# EAGLE design pendrive (EAGLE 6.4)
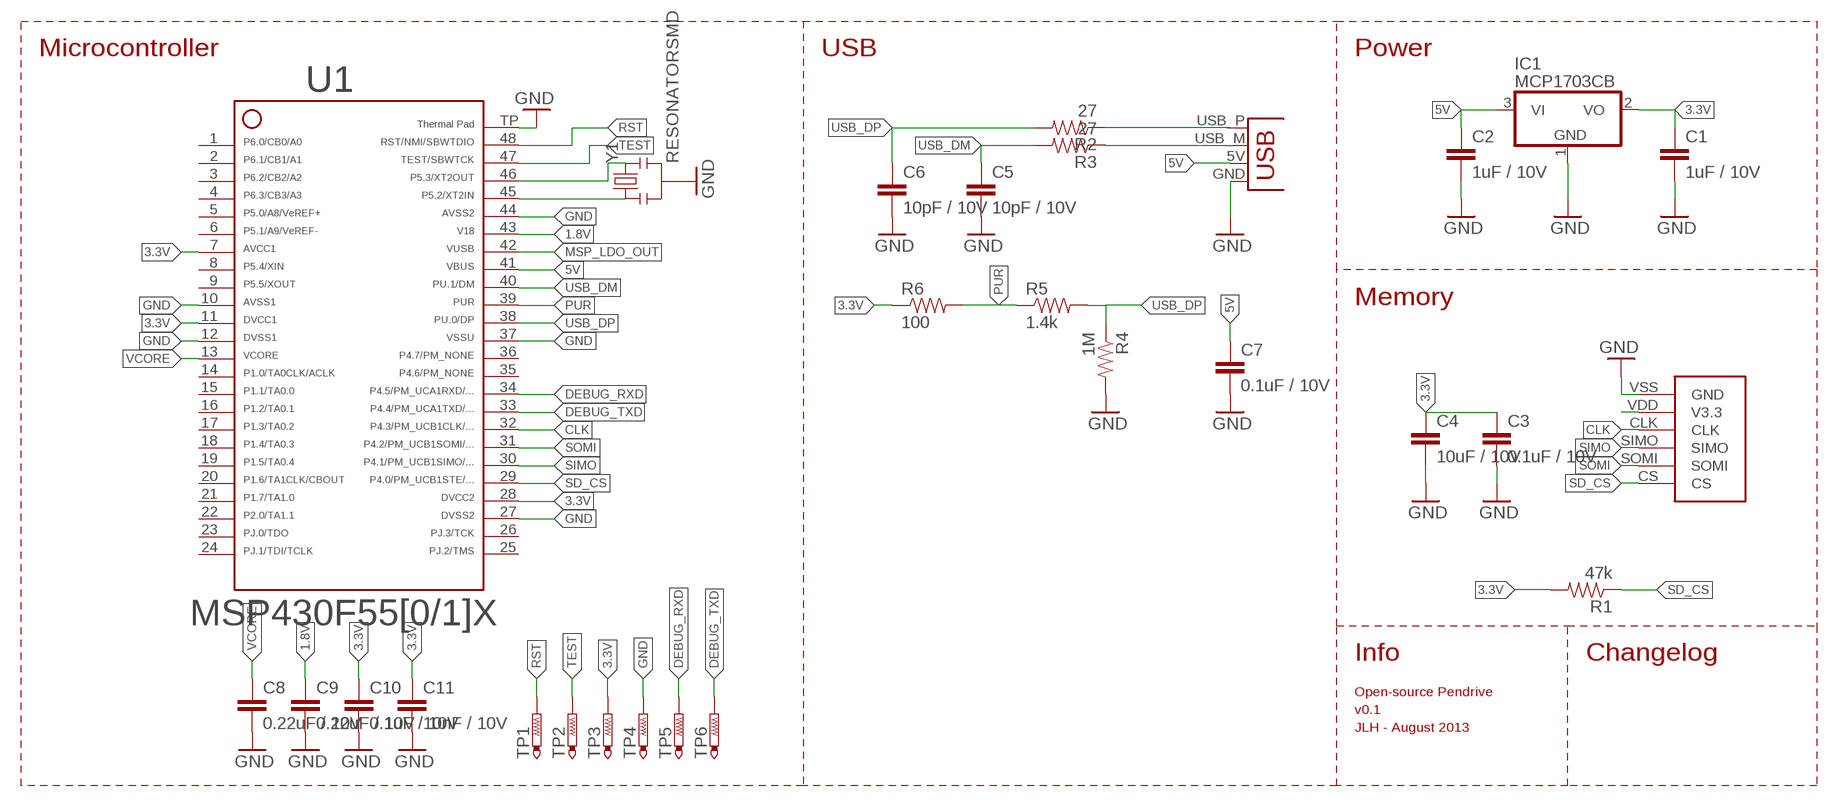
[diagram p0: schematic, sheet 1]

## Parts
C1  1uF / 10V  CAP0402-CAP  [0402-CAP]
C2  1uF / 10V  CAP0402-CAP  [0402-CAP]
C3  0.1uF / 10V  CAP0402-CAP  [0402-CAP]
C4  10uF / 10V  CAP1206  [1206]
C5  10pF / 10V  CAP0402-CAP  [0402-CAP]
C6  10pF / 10V  CAP0402-CAP  [0402-CAP]
C7  0.1uF / 10V  CAP0402-CAP  [0402-CAP]
C8  0.22uF / 10V  CAP0402-CAP  [0402-CAP]
C9  0.22uF / 10V  CAP0402-CAP  [0402-CAP]
C10  0.1uF / 10V  CAP0402-CAP  [0402-CAP]
C11  10nF / 10V  CAP0402-CAP  [0402-CAP]
IC1  MCP1703CB  [SOT23]
R1  47k  RESISTOR0402-RES  [0402-RES]
R2  27  RESISTOR0402-RES  [0402-RES]
R3  27  RESISTOR0402-RES  [0402-RES]
R4  1M  RESISTOR0402-RES  [0402-RES]
R5  1.4k  RESISTOR0402-RES  [0402-RES]
R6  100  RESISTOR0402-RES  [0402-RES]
TP1  PTR1TP10SQ  [TP10SQ]
TP2  PTR1TP10SQ  [TP10SQ]
TP3  PTR1TP10SQ  [TP10SQ]
TP4  PTR1TP10SQ  [TP10SQ]
TP5  PTR1TP10SQ  [TP10SQ]
TP6  PTR1TP10SQ  [TP10SQ]
U1  F55[0/1]X---RGZ48  [RGZ48]
U2  MICROSD-MOLEX  [MICROSD-MOLEX]
X1  USBPCB  [USB-A-PCB]
Y1  RESONATORSMD  [RESONATOR-SMD]

## Nets
1.8V: C9.1 U1.43
3.3V: C1.1 C3.1 C4.1 C10.1 C11.1 IC1.2(VO) R1.2 R6.1 TP3.TP U1.7 U1.11 U1.28 U2.VDD(V3.3)
5V: C2.1 C7.1 IC1.3(VI) U1.41 X1.5V(VBUS)
CLK: U1.32 U2.CLK
DEBUG_RXD: TP5.TP U1.34
DEBUG_TXD: TP6.TP U1.33
GND: C1.2 C2.2 C3.2 C4.2 C5.2 C6.2 C7.2 C8.2 C9.2 C10.2 C11.2 IC1.1(GND) R4.2 TP4.TP U1.10 U1.12 U1.27 U1.37 U1.44 U1.TP U2.VSS(GND) X1.GND Y1.2
MSP_LDO_OUT: U1.42
N$1: R2.1 X1.USB_P(D+)
N$2: R3.1 X1.USB_M(D-)
N$4: U1.45 Y1.1
N$5: U1.46 Y1.3
PUR: R5.1 R6.2 U1.39
RST: TP1.TP U1.48
SD_CS: R1.1 U1.29 U2.CS
SIMO: U1.30 U2.SIMO
SOMI: U1.31 U2.SOMI
TEST: TP2.TP U1.47
USB_DM: C5.1 R3.2 U1.40
USB_DP: C6.1 R2.2 R4.1 R5.2 U1.38
VCORE: C8.1 U1.13
Unconnected: U1.1 U1.2 U1.3 U1.4 U1.5 U1.6 U1.8 U1.9 U1.14 U1.15 U1.16 U1.17 U1.18 U1.19 U1.20 U1.21 U1.22 U1.23 U1.24 U1.25 U1.26 U1.35 U1.36

## Notes on the sheet
- Microcontroller | USB | Power
- Memory
- Info | Changelog
- Open-source Pendrive
- v0.1
- JLH - August 2013

## Library data of the parts
C1-C11 = SparkFun:CAP: Capacitor Standard 0603 ceramic capacitor, and 0.1" leaded capacitor.
IC1 = linear:MCP1703: 250 mA, 16V, Low Quiescent Current LDO Regulator Source: http://ww1.microchip.com/downloads/en/DeviceDoc/22049b.pdf
R1-R6 = SparkFun:RESISTOR: Resistor Basic schematic elements and footprints for 0603, 1206, and PTH resistors.
TP1-TP6 = testpad:PTR1: TEST PIN
U1 = TI_MSP430_v16:F55[0/1]X---RGZ48: ***F55[0/1/2]X*** RGZ48 Rev. 1.0 06/2010 "http://www.ti.com/lit/gpn/msp430f5509"
U2 = Satelinx:MICROSD-MOLEX
X1 = SparkFun:USB: USB Connectors USB-B-PTH is fully proven SKU : PRT-00139 USB-miniB is fully proven SKU : PRT-00587 USB-A-PCB is untested. USB-A-H is throughly reviewed, but untested. Spark Fun Electronics SKU : PRT-00437 USB-B-SMT is throughly reviewed, but untested. Needs silkscreen touching up. USB-A-S has not been used/tested USB-MB-H has not been used/tested
Y1 = SparkFun:RESONATOR: Resonator Small SMD resonator. This is the itty bitty 10/20MHz resonators with built in caps. CSTCE10M0G55 and CSTCE20M0V53. Footprint has been reviewed closely but hasn't been tested yet.

## Board
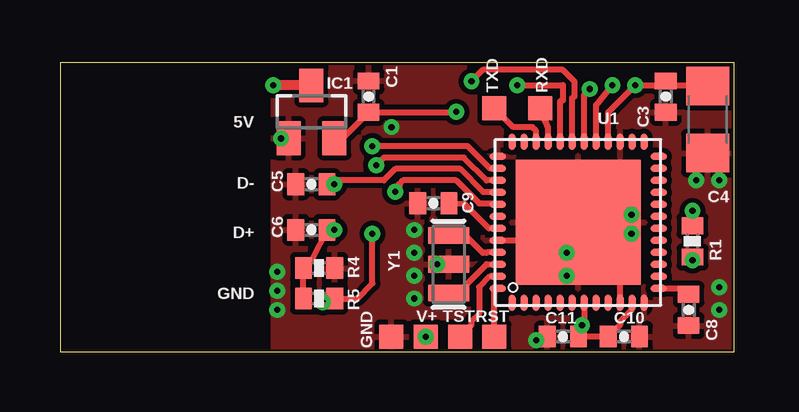
[diagram p1: board, top side]
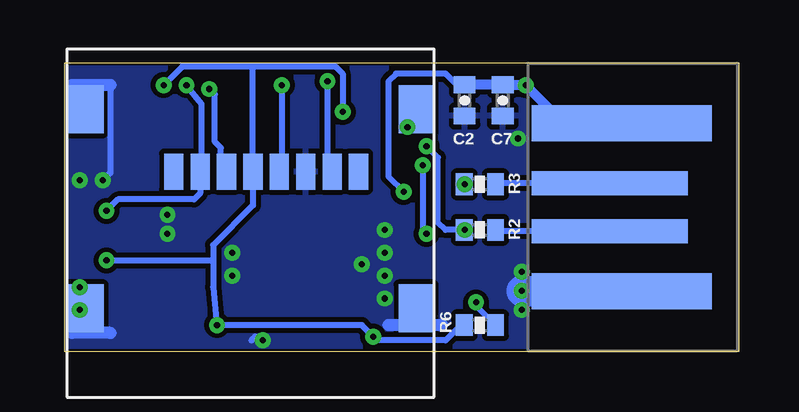
[diagram p2: board, bottom side, seen from below]

Size 28.09 x 12.05 mm. Coordinates in mm from the lower left corner, seen from the top.
Outline: 0,0 28.09,0 28.09,12.05 0,12.05 0,0
Copper layers (1*16): Top 0.035mm / dielectric 1.5mm / Bottom 0.035mm
Design rules "default *": minimum track width 8mil, minimum drill 10mil, track to track 8mil, track to pad 8mil, pad to pad 8mil, via to via 8mil, smd to smd 8mil, copper to edge 4mil, drill to drill 8mil, minimum pad ring 10mil, minimum via ring 8mil, stop-mask expansion 4mil, vias tented up to drill 0mil, thermal gap 8mil

### Footprints (pad centres in the part's own frame; a part is rotated, then mirrored left to right if it is on the bottom)
0402-CAP = smd 0.7 x 0.9: 1 -0.65,0; 2 0.65,0
1206 = smd 1.6 x 1.8: 1 -1.4,0; 2 1.4,0
SOT23 = smd 1 x 1.4: 1 -0.95,-1.1; 2 0.95,-1.1; 3 0,1.1
0402-RES = smd 0.7 x 0.9: 1 -0.65,0; 2 0.65,0
TP10SQ = smd 1 x 1: TP 0,0
RGZ48 = smd 0.7 x 0.3: 1 -3.35,2.75; 2 -3.35,2.25; 3 -3.35,1.75; 4 -3.35,1.25; 5 -3.35,0.75; 6 -3.35,0.25; 7 -3.35,-0.25; 8 -3.35,-0.75; 9 -3.35,-1.25; 10 -3.35,-1.75; 11 -3.35,-2.25; 12 -3.35,-2.75; 25 3.35,-2.75; 26 3.35,-2.25; 27 3.35,-1.75; 28 3.35,-1.25; 29 3.35,-0.75; 30 3.35,-0.25; 31 3.35,0.25; 32 3.35,0.75; 33 3.35,1.25; 34 3.35,1.75; 35 3.35,2.25; 36 3.35,2.75 | smd 0.3 x 0.7: 13 -2.75,-3.35; 14 -2.25,-3.35; 15 -1.75,-3.35; 16 -1.25,-3.35; 17 -0.75,-3.35; 18 -0.25,-3.35; 19 0.25,-3.35; 20 0.75,-3.35; 21 1.25,-3.35; 22 1.75,-3.35; 23 2.25,-3.35; 24 2.75,-3.35; 37 2.75,3.35; 38 2.25,3.35; 39 1.75,3.35; 40 1.25,3.35; 41 0.75,3.35; 42 0.25,3.35; 43 -0.25,3.35; 44 -0.75,3.35; 45 -1.25,3.35; 46 -1.75,3.35; 47 -2.25,3.35; 48 -2.75,3.35 | smd 5.2 x 5.2: TP 0,0
MICROSD-MOLEX = smd 0.8 x 1.5: CLK 6.45,3.6; CS 9.75,3.6; DAT1 3.15,3.6; DAT2 10.85,3.6; SIMO 8.65,3.6; SOMI 4.25,3.6; VDD 7.55,3.6; VSS 5.35,3.6 | smd 1.45 x 2: SHIELD1 0.75,9.3; SHIELD2 0.75,1; SHIELD3 14.5,1; SHIELD4 14.5,9.3
USB-A-PCB = smd 7.5 x 1.5: 5V -0.2,-3.5; GND -0.2,3.5 | smd 6.5 x 1: USB_M 0.3,-1; USB_P 0.3,1
RESONATOR-SMD = smd 0.7 x 1.7: 1 -1.2,0; 2 0,0; 3 1.2,0

### Placement (x,y rotation side)
C1  12.86,10.64 90 top
C2  11.43,10.48 270 bottom
C3  25.24,10.64 270 top
C4  26.99,9.68 270 top
C5  10.48,6.99 180 top
C6  10.48,5.08 180 top
C7  9.84,10.48 270 bottom
C8  26.19,1.75 270 top
C9  15.56,6.19 180 top
C10  23.5,0.64 0 top
C11  20.95,0.64 180 top
IC1  10.48,10 0 top
R1  26.35,4.6 270 top
R2  10.79,5.08 180 bottom
R3  10.79,6.99 180 bottom
R4  10.79,3.49 0 top
R5  10.79,2.22 180 top
R6  10.79,1.11 0 bottom
TP1  18.1,0.64 0 top
TP2  16.67,0.64 0 top
TP3  15.24,0.64 0 top
TP4  13.81,0.64 0 top
TP5  18.1,10.16 0 top
TP6  20,10.16 0 top
U1  21.59,5.4 90 top
U2  12.7,11.11 180 bottom
X1  5.08,6.03 180 bottom
Y1  16.19,3.65 270 top

### Tracks (layer width: path | path; a pad name or v marks a point on that pad's centre or on a via)
1.8V
  Top 0.254: C9.1 16.84,6.18 17.87,5.15 U1.43
3.3V  (via drill 0.25)
  Top 0.254: U1.7 21.84,1.2 v21.75,1.11 21.61,0.97 C11.1 C10.1 23.34,1.13 23.34,1.27 23.84,1.77 U1.11 | IC1.2 11.77,8.9 C1.1 16.5,9.99 v16.51,10 | U1.28 22.84,9.98 v23.97,11.11 25.39,11.11 | 25.39,11.11 C3.1 | 25.39,11.11 26.96,11.11 C4.1 | R1.2 v26.35,3.81
  Bottom 0.254: 20.16,11.91 23.18,11.91 v23.97,11.11 | 20.16,11.91 16.83,11.91 16.51,11.59 v16.51,10 | 20.16,11.91 20.25,11.82 U2.VDD 20.25,6.1 21.91,4.45 21.91,3.81 | 21.91,3.81 21.91,2.7 v21.75,1.11 21.61,1.13 21.61,1.11 15.72,1.11 TP3.TP 15.08,0.48 12.22,0.48 11.59,1.11 R6.1 | v26.35,3.81 21.91,3.81
  other vias: 15.24,0.64
5V  (via drill 0.25)
  Top 0.254: U1.41 18.2,6.19 17.46,6.19 16.51,7.14 14.29,7.14 14.13,6.99 14.13,6.83 v13.97,6.67
  Top 0.406: IC1.3 v8.9,11.1 v8.89,11.11
  Bottom 0.254: C2.1 11.76,11.13 12.22,11.59 14.29,11.59 14.61,11.27 14.61,7.3 v13.97,6.67
  Bottom 0.406: X1.5V 7.31,9.53 v8.89,11.11 8.9,11.13 C7.1 | 9.83,11.11 C7.1 | C7.1 C2.1
CLK  (via drill 0.25)
  Top 0.254: U1.32 20.84,10.43 20.95,10.48 20.95,11.11 v19.05,11.11
  Bottom 0.254: v19.05,11.11 19.05,7.89 U2.CLK
DEBUG_RXD
  Top 0.254: U1.34 19.84,9.21 19.68,9.37 18.89,9.37 TP5.TP
DEBUG_TXD
  Top 0.254: U1.33 20.34,9.35 TP6.TP
GND  (via drill 0.25)
  Top 0.254: U1.44 20.59,4.65 v21.11,4.13 | U1.10 23.34,4.45 v23.81,4.92 | C11.2 v19.84,0.48
  Top 0.508: v21.11,4.13 23.02,4.13 v23.81,4.92
  Bottom 0.254: v19.84,0.48 20.16,0.64 20.32,0.48 | 26.19,11.11 26.19,7.46 v26.51,7.14 | 26.19,0.79 26.51,0.79 v27.46,1.75
  Bottom 0.508: 12.38,1.11 14.61,1.11 | 26.19,11.11 27.78,11.11 | 26.19,0.79 27.78,0.79
  Bottom 1.27: X1.GND v9.04,2.53 v9.05,2.54
  other vias: 9.05,3.33 9.05,1.75 14.76,2.22 14.76,3.17 14.76,4.13 14.76,5.08 15.72,3.65 23.81,5.71 13.81,9.37 27.46,2.7 21.11,3.17 27.46,7.14 9.21,8.89
  pour Bottom: 8.89,12.06 8.89,0 28.26,0 28.26,12.06
  pour Top: 8.89,12.06 8.89,0 28.26,0 28.26,12.06
N$1
  Bottom 0.254: X1.USB_P 10.1,5.03 R2.1
N$2
  Bottom 0.254: X1.USB_M 10.1,7.03 R3.1
N$4
  Top 0.254: U1.45 17.8,4.15 17.78,4.13 17.62,4.13 16.83,4.92 16.26,4.92 Y1.1
N$5
  Top 0.254: Y1.3 16.58,2.45 17.78,3.65 U1.46
PUR  (via drill 0.25)
  Top 0.254: v13.02,4.92 13.02,2.86 12.38,2.22 R5.1 11.41,2.19 11.08,2.19 v10.95,2.06 | U1.39 17.78,7.15 16.83,8.1 13.49,8.1 v13.18,7.78
  Bottom 0.254: v13.18,7.78 13.18,5.08 v13.02,4.92 | v10.95,2.06 10.95,1.92 R6.2
RST
  Top 0.254: TP1.TP 18.1,2.5 U1.48
SD_CS  (via drill 0.25)
  Top 0.254: v26.35,5.87 R1.1 | U1.29 22.34,10.28 v23.02,11.11
  Bottom 0.254: v26.35,5.87 25.88,6.35 22.7,6.35 22.45,6.6 U2.CS 22.38,7.58 22.38,10.32 v23.02,11.11
SIMO  (via drill 0.25)
  Top 0.254: U1.30 21.84,10.7 v22.07,10.95
  Bottom 0.254: U2.SIMO 21.59,7.75 21.59,8.5 U1.30 21.84,10.73 v22.07,10.95
SOMI  (via drill 0.25)
  Top 0.254: U1.31 21.34,10.57 21.43,10.64 21.43,11.27 20.95,11.75 17.62,11.75 v17.14,11.27
  Bottom 0.254: v17.14,11.27 17.14,7.71 U2.SOMI
TEST
  Top 0.254: U1.47 17.91,3.15 17.46,2.7 17.46,1.59 17.14,1.27 17.14,1.11 TP2.TP
USB_DM  (via drill 0.25)
  Top 0.254: C5.1 v11.43,6.99 | 11.45,6.97 v11.43,6.99 | U1.40 18.22,6.67 17.62,6.67 16.67,7.62 13.97,7.62 13.49,7.14 11.59,7.14 v11.43,6.99
  Bottom 0.254: v11.43,6.99 R3.2
USB_DP  (via drill 0.25)
  Top 0.254: R5.2 R4.1 10.49,3.84 C6.1 v11.43,5.08 | U1.38 17.91,7.65 16.99,8.57 v13.02,8.57
  Bottom 0.254: v11.43,5.08 R2.2 12.22,5.08 12.54,5.4 12.54,8.1 v13.02,8.57
VCORE
  Top 0.254: U1.13 25.94,2.65 C8.1

### Text on the board
tNames: TXD | RXD | 5V | D- | D+ | GND | V+ | TST | RST | GND